# EAGLE design Butia Eagle v9 (EAGLE 5.09)
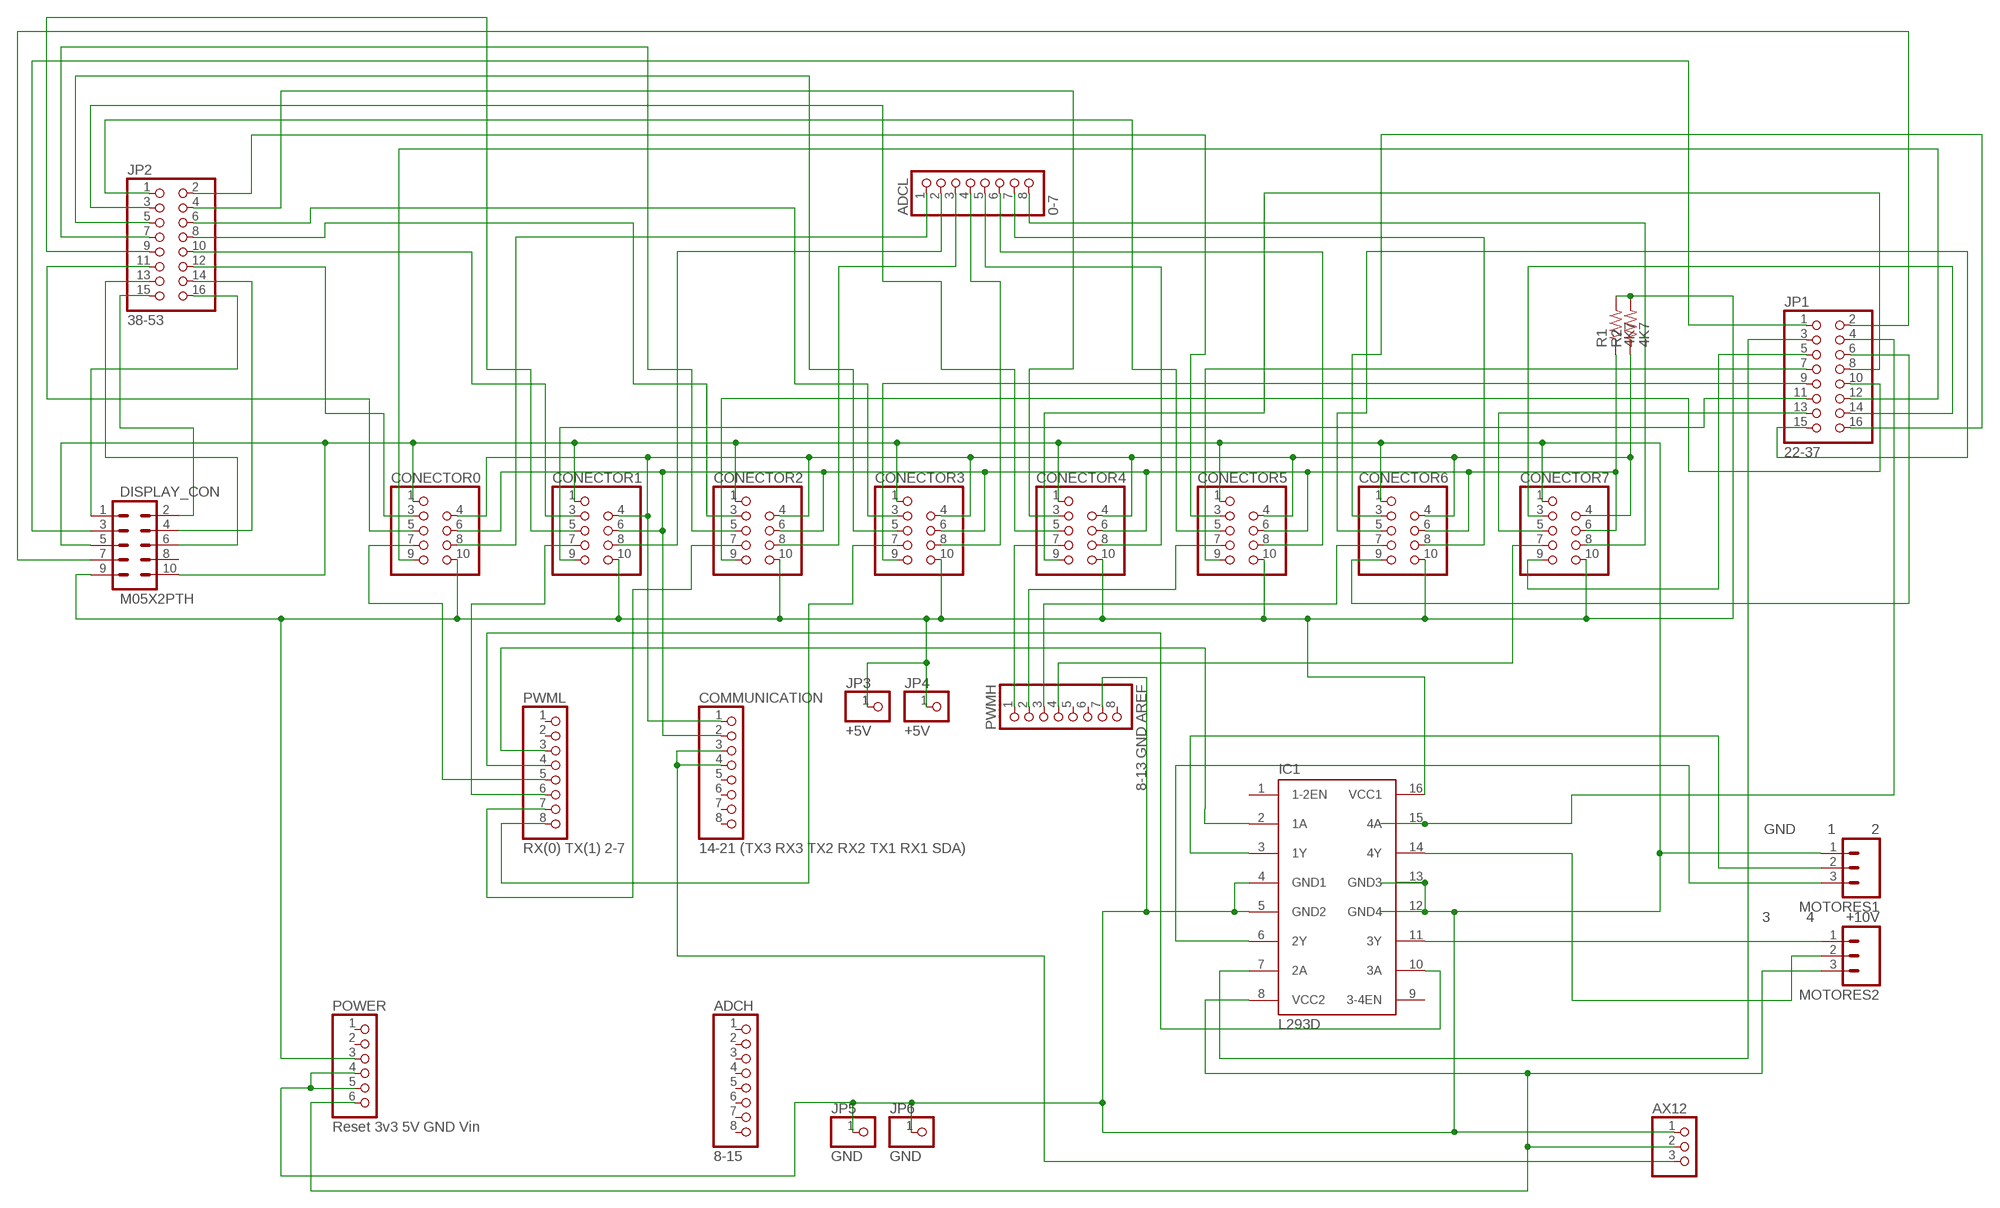
[diagram p0: schematic, sheet 1]

## Parts
ADCH  8-15  PINHD-1X8  [1X08]
ADCL  0-7  PINHD-1X8  [1X08]
AX12  AX12  [AX12]
COMMUNICATION  14-21 (TX3 RX3 TX2 RX2 TX1 RX1 SDA)  PINHD-1X8  [1X08]
CONECTOR0  9PIN  [9PIN]
CONECTOR1  9PIN  [9PIN]
CONECTOR2  9PIN  [9PIN]
CONECTOR3  9PIN  [9PIN]
CONECTOR4  9PIN  [9PIN]
CONECTOR5  9PIN  [9PIN]
CONECTOR6  9PIN  [9PIN]
CONECTOR7  9PIN  [9PIN]
DISPLAY_CON  M05X2PTH  [AVR_ICSP]
IC1  L293D  [DIL16]
JP1  22-37  PINHD-2X8  [2X08]
JP2  38-53  PINHD-2X8  [2X08]
JP3  +5V  PINHD-1X1  [1X01]
JP4  +5V  PINHD-1X1  [1X01]
JP5  GND  PINHD-1X1  [1X01]
JP6  GND  PINHD-1X1  [1X01]
MOTORES1  GND 1 2  M03SCREW_LOCK  [SCREWTERMINAL-3.5MM-3_LOCK.007S]
MOTORES2  3 4 +10V  M03SCREW_LOCK  [SCREWTERMINAL-3.5MM-3_LOCK.007S]
POWER  Reset 3v3 5V GND Vin  PINHD-1X6  [1X06]
PWMH  8-13 GND AREF  PINHD-1X8  [1X08]
PWML  RX(0) TX(1) 2-7  PINHD-1X8  [1X08]
R1  4K7  R-US_0207/7  [0207/7]
R2  4K7  R-US_0207/7  [0207/7]

## Nets
+10V [power]: AX12.2 IC1.8(VCC2) MOTORES2.3 POWER.6
MASA [gnd]: AX12.1 CONECTOR0.1 CONECTOR1.1 CONECTOR2.1 CONECTOR3.1 CONECTOR4.1 CONECTOR5.1 CONECTOR6.1 CONECTOR7.1 DISPLAY_CON.5 DISPLAY_CON.10 IC1.4(GND1) IC1.5(GND2) IC1.12(GND4) IC1.13(GND3) JP5.1 JP6.1 MOTORES1.1 POWER.4 POWER.5 PWMH.7
N$1: CONECTOR0.5 JP2.11
N$2: CONECTOR0.3 JP2.12
N$3: CONECTOR1.5 JP2.9
N$4: CONECTOR1.3 JP2.10
N$5: CONECTOR2.5 JP2.7
N$6: CONECTOR2.3 JP2.8
N$7: IC1.10(3A) PWML.4
N$8: CONECTOR3.5 JP2.5
N$9: CONECTOR3.3 JP2.6
N$10: CONECTOR4.3 JP2.4
N$11: CONECTOR4.5 JP2.3
N$13: CONECTOR5.3 JP2.2
N$15: CONECTOR6.3 JP1.16
N$16: CONECTOR7.5 JP1.13
N$17: CONECTOR7.3 JP1.14
N$18: ADCL.1 CONECTOR0.8
N$19 [polenta]: IC1.14(4Y) MOTORES2.2
N$20 [polenta]: IC1.11(3Y) MOTORES2.1
N$21 [polenta]: IC1.6(2Y) MOTORES1.3
N$22 [polenta]: IC1.3(1Y) MOTORES1.2
N$23: ADCL.2 CONECTOR1.8
N$24: ADCL.3 CONECTOR2.8
N$25: ADCL.4 CONECTOR3.8
N$26: ADCL.5 CONECTOR4.8
N$27: ADCL.6 CONECTOR5.8
N$28: ADCL.7 CONECTOR6.8
N$29: ADCL.8 CONECTOR7.8
N$30: AX12.3 COMMUNICATION.3 COMMUNICATION.4
N$31: IC1.2(1A) PWML.3
N$33: CONECTOR0.7 PWML.5
N$34: CONECTOR1.7 PWML.6
N$35: CONECTOR2.7 PWML.7
N$36: CONECTOR3.7 PWML.8
N$37: CONECTOR4.7 PWMH.1
N$38: CONECTOR5.7 PWMH.2
N$39: CONECTOR6.7 PWMH.3
N$40: CONECTOR7.7 PWMH.4
N$41: DISPLAY_CON.7 JP1.2
N$42: DISPLAY_CON.3 JP1.1
N$43: IC1.7(2A) JP1.3
N$44: IC1.15(4A) JP1.4
N$45: CONECTOR7.9 JP1.5
N$46: CONECTOR6.9 JP1.6
N$47: CONECTOR5.9 JP1.7
N$48: CONECTOR4.9 JP1.8
N$49: CONECTOR3.9 JP1.9
N$50: CONECTOR2.9 JP1.10
N$51: CONECTOR1.9 JP1.11
N$52: CONECTOR0.9 JP1.12
N$53: CONECTOR5.5 JP2.1
N$54: CONECTOR6.5 JP1.15
N$55: DISPLAY_CON.1 JP2.16
N$56: DISPLAY_CON.2 JP2.15
N$57: DISPLAY_CON.4 JP2.14
N$58: DISPLAY_CON.6 JP2.13
POSITIVO [power]: CONECTOR0.10 CONECTOR1.10 CONECTOR2.10 CONECTOR3.10 CONECTOR4.10 CONECTOR5.10 CONECTOR6.10 CONECTOR7.10 DISPLAY_CON.9 IC1.16(VCC1) JP3.1 JP4.1 POWER.3 R1.2 R2.2
SCL: COMMUNICATION.1 CONECTOR0.4 CONECTOR1.4 CONECTOR2.4 CONECTOR3.4 CONECTOR4.4 CONECTOR5.4 CONECTOR6.4 CONECTOR7.4 R2.1
SDA: COMMUNICATION.2 CONECTOR0.6 CONECTOR1.6 CONECTOR2.6 CONECTOR3.6 CONECTOR4.6 CONECTOR5.6 CONECTOR6.6 CONECTOR7.6 R1.1
Unconnected: ADCH.1 ADCH.2 ADCH.3 ADCH.4 ADCH.5 ADCH.6 ADCH.7 ADCH.8 COMMUNICATION.5 COMMUNICATION.6 COMMUNICATION.7 COMMUNICATION.8 DISPLAY_CON.8 IC1.1(1-2EN) IC1.9(3-4EN) POWER.1 POWER.2 PWMH.5 PWMH.6 PWMH.8 PWML.1 PWML.2

## Library data of the parts
ADCH ADCL COMMUNICATION PWMH PWML = pinhead:PINHD-1X8: PIN HEADER
AX12 = butia:AX12
CONECTOR0 CONECTOR1-CONECTOR7 = butia:9PIN
DISPLAY_CON = SparkFun:M05X2: Header 5x2 Standard 10-pin dual row 0.1" header. Commonly used with AVR-ISP. Use with Spark Fun Electronics SKU: PRT-00778
IC1 = st-microelectronics:L293D: PUSH-PULL 4 CHANNEL DRIVER
JP1 JP2 = pinhead:PINHD-2X8: PIN HEADER
JP3-JP6 = pinhead:PINHD-1X1: PIN HEADER
MOTORES1 MOTORES2 = SparkFun:M03: Header 3 Standard 3-pin 0.1" header. Use with straight break away headers (SKU : PRT-00116), right angle break away headers (PRT-00553), swiss pins (PRT-00743), machine pins (PRT-00117), and female headers (PRT-00115). Molex polarized connector foot print use with SKU : PRT-08232 with associated crimp pins and housings.
POWER = pinhead:PINHD-1X6: PIN HEADER
R1 R2 = resistor:R-US_: RESISTOR, American symbol

## Net classes
0 default: width 0.254 mm, drill 0.457 mm, clearance 0.203 mm
1 power: width 0.508 mm, drill 0.711 mm, clearance 0.203 mm
2 gnd: width 0.406 mm, drill 0.61 mm, clearance 0.203 mm
3 polenta: width 0.356 mm, drill 0.508 mm, clearance 0.203 mm

## Board
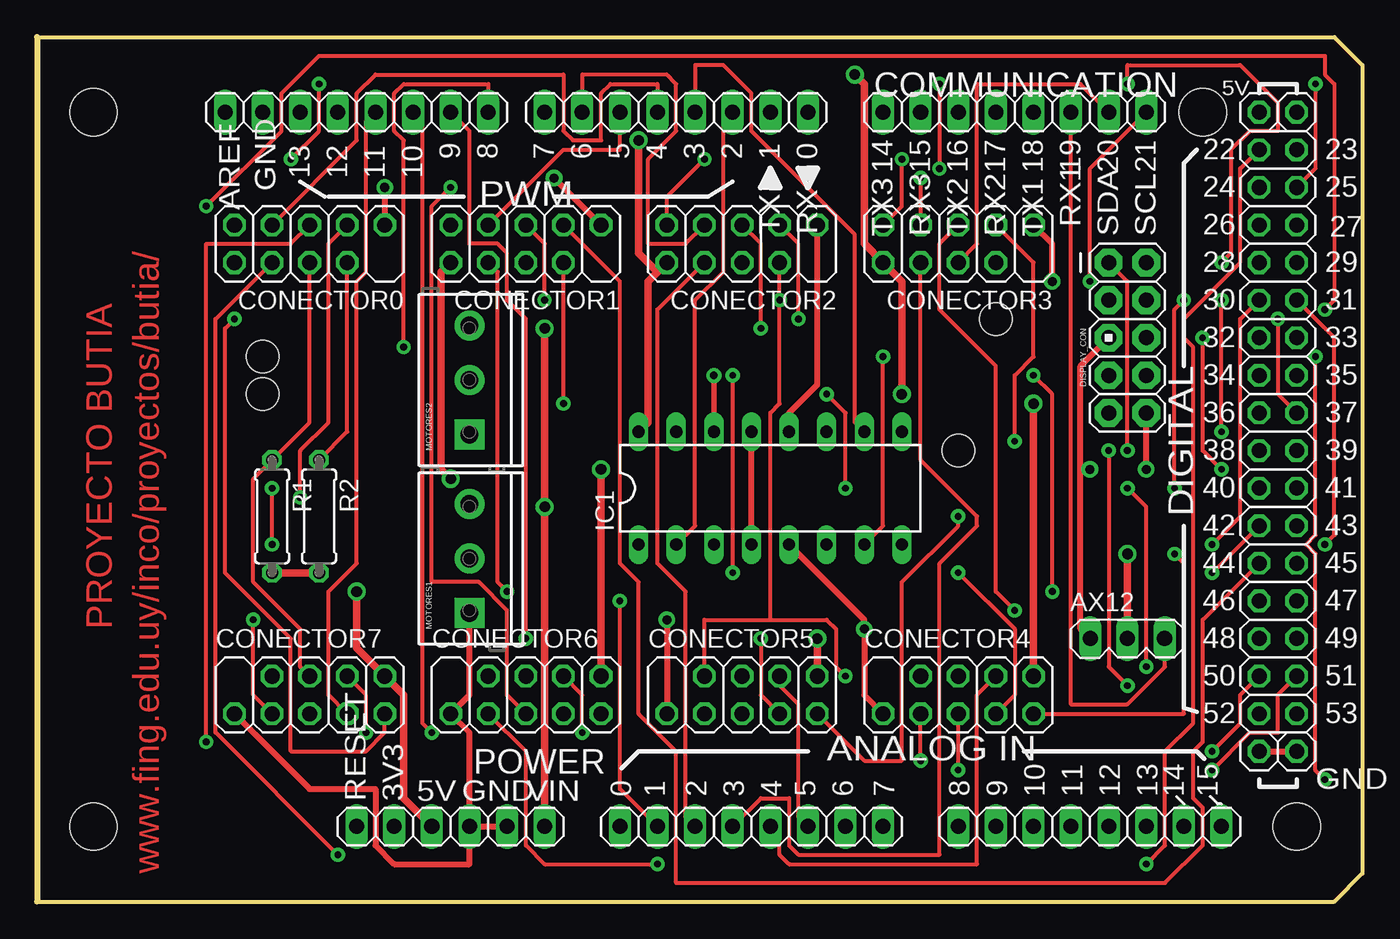
[diagram p1: board, top side]
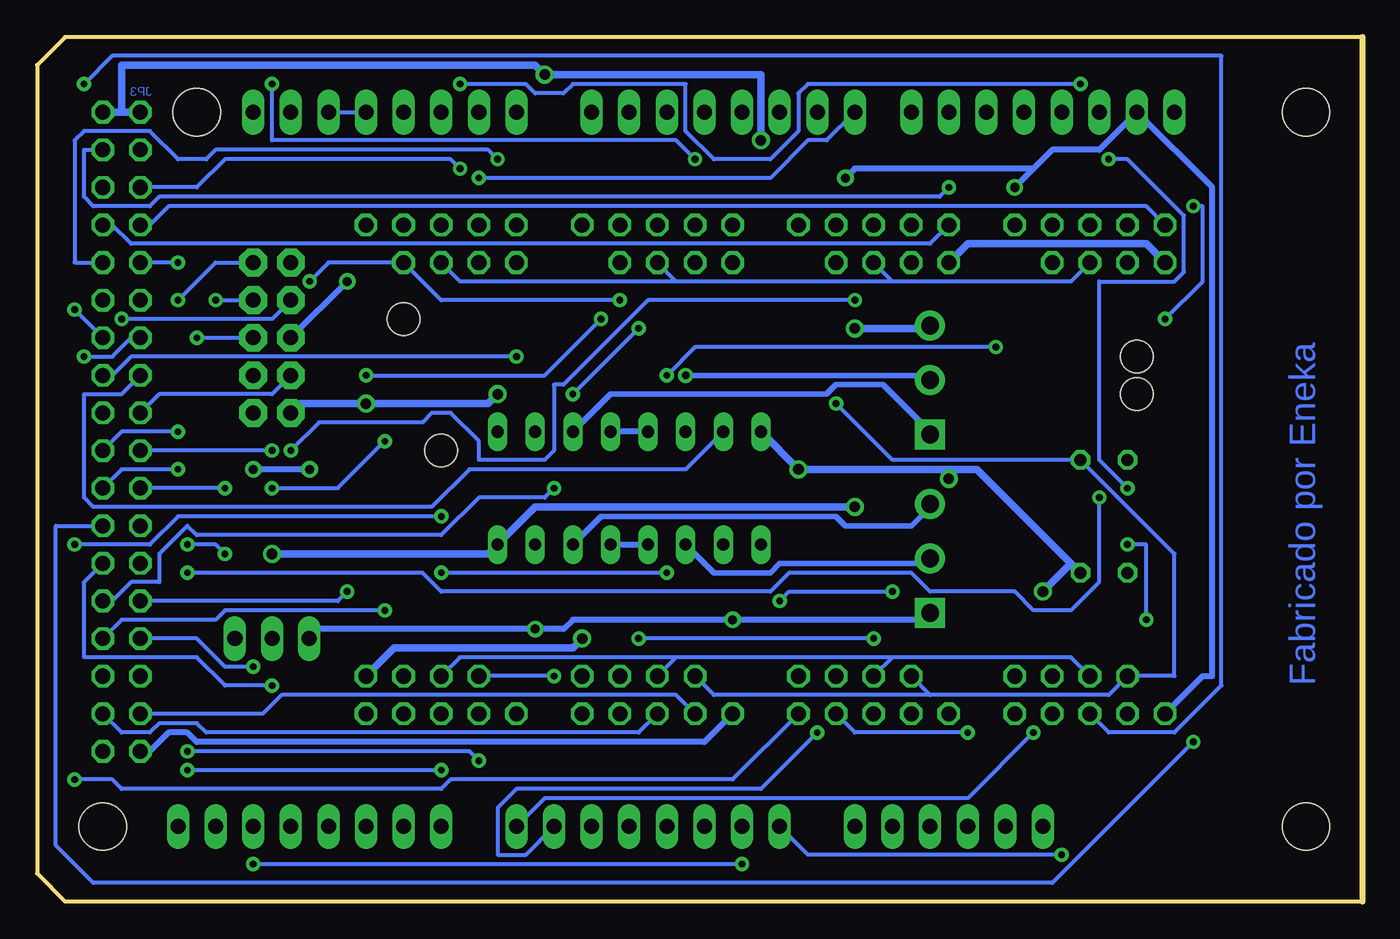
[diagram p2: board, bottom side, seen from below]

Size 89.53 x 58.42 mm. Coordinates in mm from the lower left corner, seen from the top.
Outline: 0,58.42 87.63,58.42 89.53,56.52 89.53,1.91 87.63,0 0,0 0,58.42
Copper layers (1*16): Top 0.035mm / dielectric 1.5mm / Bottom 0.035mm
Design rules "default *": minimum track width 8mil, minimum drill 16mil, track to track 8mil, track to pad 8mil, pad to pad 8mil, via to via 10mil, smd to smd 8mil, copper to edge 40mil, drill to drill 12mil, minimum pad ring 10mil, minimum via ring 10mil, stop-mask expansion 4mil, vias tented up to drill 0mil, thermal gap 10mil
Holes 3.2 mm at 85.09,5.08 3.81,53.34 78.74,53.34 3.81,5.08
Holes 2.2 mm at 64.77,39.37 15.24,36.83 15.24,34.29 62.23,30.48

### Footprints (pad centres in the part's own frame; a part is rotated, then mirrored left to right if it is on the bottom)
1X08 = drill 1.016 long: 1 -8.89,0; 2 -6.35,0; 3 -3.81,0; 4 -1.27,0; 5 1.27,0; 6 3.81,0; 7 6.35,0; 8 8.89,0
AX12 = drill 1.016 long: 1 -2.498,0; 2 0,0; 3 2.507,0.005
9PIN = drill 1.016 octagon: 1 -5.08,-1.27; 3 -2.54,-1.27; 4 -2.54,1.27; 5 0,-1.27; 6 0,1.27; 7 2.54,-1.27; 8 2.54,1.27; 9 5.08,-1.27; 10 5.08,1.27
AVR_ICSP = drill 1.016 pad 1.88 octagon: 1 -1.27,5.08; 2 1.27,5.08; 3 -1.27,2.54; 4 1.27,2.54; 5 -1.27,0; 6 1.27,0; 7 -1.27,-2.54; 8 1.27,-2.54; 9 -1.27,-5.08; 10 1.27,-5.08
DIL16 = drill 0.813 long: 1 -8.89,-3.81; 2 -6.35,-3.81; 3 -3.81,-3.81; 4 -1.27,-3.81; 5 1.27,-3.81; 6 3.81,-3.81; 7 6.35,-3.81; 8 8.89,-3.81; 9 8.89,3.81; 10 6.35,3.81; 11 3.81,3.81; 12 1.27,3.81; 13 -1.27,3.81; 14 -3.81,3.81; 15 -6.35,3.81; 16 -8.89,3.81
2X08 = drill 1.016 octagon: 1 -8.89,-1.27; 2 -8.89,1.27; 3 -6.35,-1.27; 4 -6.35,1.27; 5 -3.81,-1.27; 6 -3.81,1.27; 7 -1.27,-1.27; 8 -1.27,1.27; 9 1.27,-1.27; 10 1.27,1.27; 11 3.81,-1.27; 12 3.81,1.27; 13 6.35,-1.27; 14 6.35,1.27; 15 8.89,-1.27; 16 8.89,1.27
1X01 = drill 1.016 octagon: 1 0,0
SCREWTERMINAL-3.5MM-3_LOCK.007S = drill 1.2 pad 2.032 square: 1 -0.178,0 | drill 1.2 pad 2.032 round: 2 3.5,0; 3 7.178,0
1X06 = drill 1.016 long: 1 -6.35,0; 2 -3.81,0; 3 -1.27,0; 4 1.27,0; 5 3.81,0; 6 6.35,0
0207/7 = drill 0.813 octagon: 1 -3.81,0; 2 3.81,0

### Placement (x,y rotation side)
ADCH  71.12,5.08 0 top
ADCL  48.26,5.08 0 top
AX12  73.66,17.78 0 top
COMMUNICATION  66.04,53.34 180 top
CONECTOR0  18.41,44.45 180 top
CONECTOR1  33.02,44.45 180 top
CONECTOR2  47.62,44.45 180 top
CONECTOR3  62.23,44.45 180 top
CONECTOR4  62.23,13.97 0 top
CONECTOR5  47.62,13.97 0 top
CONECTOR6  33.02,13.97 0 top
CONECTOR7  18.41,13.97 0 top
DISPLAY_CON  73.66,38.1 0 top
IC1  49.53,27.94 0 top
JP1  83.82,41.91 90 top
JP2  83.82,21.59 90 top
JP3  82.55,53.34 0 top
JP4  85.09,53.34 0 top
JP5  82.55,10.16 0 top
JP6  85.09,10.16 0 top
MOTORES1  29.21,19.68 90 top
MOTORES2  29.21,31.75 90 top
POWER  27.94,5.08 0 top
PWMH  21.59,53.34 180 top
PWML  43.18,53.34 180 top
R1  15.88,26.04 270 top
R2  19.05,26.04 270 top

### Tracks (layer width: path | path; a pad name or v marks a point on that pad's centre or on a via)
+10V  (via drill 0.71)
  Top 0.508: v73.66,23.49 AX12.2 | v34.29,38.73 v34.29,26.67 POWER.6
  Bottom 0.508: v73.66,23.49 59.05,23.49 IC1.8 55.88,26.67 v34.29,26.67 | v34.29,38.73 29.21,38.73 MOTORES2.3
MASA  (via drill 0.61)
  Top 0.406: JP5.1 JP6.1 | CONECTOR2.1 52.71,34.92 50.8,33.02 IC1.12 | CONECTOR4.1 55.88,13.97 v55.88,18.41 55.88,19.05 IC1.5 | IC1.4 IC1.13 | 70.49,29.21 70.49,36.2 DISPLAY_CON.5 | 70.49,29.21 70.49,18.41 71.12,17.78 AX12.1 | CONECTOR3.1 68.58,44.45 v68.58,41.91 | v74.93,29.21 DISPLAY_CON.10 | 70.49,29.21 v71.12,29.21 | MOTORES1.1 29.21,13.97 CONECTOR6.1 29.21,11.43 POWER.4 | CONECTOR7.1 18.41,7.62 22.86,7.62 22.86,3.81 24.13,2.54 29.21,2.54 POWER.4 | POWER.4 POWER.5 | v23.49,48.26 CONECTOR0.1 | v34.92,48.89 CONECTOR1.1 | v42.55,19.05 CONECTOR5.1
  Bottom 0.406: CONECTOR5.1 44.45,10.8 78.74,10.8 79.38,11.43 80.65,11.43 81.91,10.16 JP5.1 | IC1.13 IC1.12 | IC1.5 IC1.4 | DISPLAY_CON.5 v68.58,41.91 | v71.12,29.21 v74.93,29.21 | CONECTOR7.1 10.8,15.24 10.16,15.24 10.16,48.26 PWMH.7 17.78,50.8 20.95,50.8 22.23,49.53 | 22.23,49.53 v23.49,48.26 | v34.92,48.89 34.29,49.53 22.23,49.53 | AX12.1 71.12,17.78 70.49,18.41 v55.88,18.41 53.98,18.41 53.34,19.05 v42.55,19.05 29.21,19.05 MOTORES1.1
N$1  (via drill 0.46)
  Top 0.254: CONECTOR0.5 17.14,44.45 11.43,44.45 v11.43,10.8
  Bottom 0.254: v11.43,10.8 20.95,1.27 85.72,1.27 88.26,3.81 88.26,25.4 JP2.11
N$2  (via drill 0.46)
  Top 0.254: v79.38,22.22 JP2.12 | v17.78,27.3 17.78,30.48 19.68,32.38 19.68,44.45 CONECTOR0.3
  Bottom 0.254: v79.38,22.22 63.5,22.22 62.23,20.95 40.01,20.95 38.73,22.22 30.48,22.22 29.21,20.95 23.49,20.95 22.23,19.68 19.68,19.68 17.78,21.59 v17.78,27.3
N$3  (via drill 0.46)
  Top 0.254: v73.66,14.61 72.39,15.88 v72.39,30.48 | v34.29,40.64 34.29,44.45 CONECTOR1.5
  Bottom 0.254: JP2.9 86.36,21.59 86.36,16.51 78.74,16.51 76.84,14.61 v73.66,14.61 | v72.39,30.48 70.49,32.38 63.5,32.38 62.87,33.02 61.6,33.02 59.69,31.11 59.69,29.84 55.24,29.84 54.61,30.48 54.61,34.92 53.98,34.92 48.26,40.64 v34.29,40.64
N$4
  Top 0.254: JP2.10 78.74,19.05 78.74,10.8 78.1,10.16 78.1,6.99 78.74,6.35 78.74,3.81 76.2,1.27 43.18,1.27 43.18,10.16 40.64,12.7 40.64,21.59 39.37,22.86 39.37,41.91 CONECTOR1.3
N$5  (via drill 0.46)
  Top 0.254: CONECTOR2.5 48.9,44.45 v48.9,38.73 | v53.34,34.29 54.61,33.02 v54.61,27.94
  Bottom 0.254: v53.34,34.29 v48.9,38.73 | v54.61,27.94 55.24,27.3 59.69,27.3 62.23,24.77 78.74,24.77 79.38,25.4 81.28,23.49 81.28,21.59 83.19,21.59 84.46,20.32 JP2.7
N$6  (via drill 0.46)
  Top 0.254: CONECTOR2.3 51.44,44.45 v51.44,39.37 | v67.31,35.56 68.58,34.29 v68.58,20.95
  Bottom 0.254: v51.44,39.37 55.24,35.56 v67.31,35.56 | v68.58,20.95 69.22,20.32 JP2.8
N$7
  Top 0.254: IC1.10 55.24,32.38 55.24,45.09 48.26,52.07 48.26,54.61 46.35,56.52 44.45,56.52 PWML.4
N$8  (via drill 0.46)
  Top 0.254: v66.04,19.68 64.77,20.95 64.77,36.2 60.96,40.01 60.96,44.45 CONECTOR3.5
  Bottom 0.254: JP2.5 83.82,19.05 77.47,19.05 76.84,19.68 v66.04,19.68
N$9  (via drill 0.46)
  Top 0.254: CONECTOR3.3 67.31,43.18 67.31,36.83 66.04,35.56 v66.04,31.11 | v73.66,27.94 74.93,26.67 v74.93,15.88
  Bottom 0.254: v66.04,31.11 69.22,27.94 v73.66,27.94 | v74.93,15.88 76.84,15.88 78.74,17.78 JP2.6
N$10  (via drill 0.46)
  Top 0.254: v59.69,9.53 CONECTOR4.3 | v79.38,10.16 81.28,12.07 81.28,13.97 JP2.4
  Bottom 0.254: v59.69,9.53 60.32,10.16 v79.38,10.16
N$11  (via drill 0.46)
  Top 0.254: v62.23,8.89 CONECTOR4.5 | v79.38,8.89 81.91,11.43 83.82,11.43 83.82,13.97 JP2.3
  Bottom 0.254: v62.23,8.89 v79.38,8.89
N$13
  Bottom 0.254: CONECTOR5.3 46.35,13.97 73.03,13.97 74.29,12.7 JP2.2
N$15  (via drill 0.46)
  Top 0.254: CONECTOR6.3 33.02,10.16 33.02,3.81 34.29,2.54 v41.91,2.54 | v74.93,2.54 76.2,3.81 76.2,10.16 78.1,12.07 78.1,37.46 77.47,38.1 77.47,39.37 81.28,43.18 81.28,49.53 JP1.16
  Bottom 0.254: v41.91,2.54 v74.93,2.54
N$16  (via drill 0.46)
  Top 0.254: v86.36,55.24 86.36,49.53 JP1.13
  Bottom 0.254: CONECTOR7.5 17.14,11.43 12.7,11.43 9.52,14.61 9.52,57.15 84.46,57.15 v86.36,55.24
N$17  (via drill 0.46)
  Top 0.254: CONECTOR7.3 14.61,13.97 v14.61,19.05 | v15.88,24.13 v15.88,27.94 | v17.14,50.16 19.05,52.07 v19.05,55.24 | v60.96,55.24 v60.96,49.53
  Bottom 0.254: v14.61,19.05 14.61,24.13 v15.88,24.13 | v15.88,27.94 17.78,29.84 17.78,41.91 12.7,41.91 12.07,42.55 12.07,46.35 15.88,50.16 v17.14,50.16 | v19.05,55.24 37.47,55.24 38.1,54.61 38.1,52.07 40.01,50.16 43.81,50.16 45.72,52.07 45.72,55.24 53.34,55.24 53.98,54.61 55.88,54.61 56.51,55.24 v60.96,55.24 | v60.96,49.53 61.6,50.16 76.84,50.16 78.74,48.26 JP1.14
N$18  (via drill 0.46)
  Top 0.254: v20.32,3.17 12.07,11.43 12.07,39.37 CONECTOR0.8
  Bottom 0.254: ADCL.1 37.47,3.17 v20.32,3.17
N$19  (via drill 0.51)
  Top 0.356: v45.72,35.56 IC1.14
  Bottom 0.356: v45.72,35.56 29.21,35.56 MOTORES2.2
N$20
  Bottom 0.356: IC1.11 50.8,34.29 36.2,34.29 35.56,34.92 32.38,34.92 29.21,31.75 MOTORES2.1
N$21
  Bottom 0.356: IC1.6 51.44,26.04 35.56,26.04 34.92,25.4 30.48,25.4 29.21,26.67 MOTORES1.3
N$22
  Bottom 0.356: IC1.3 43.81,22.22 40.01,22.22 39.37,22.86 29.21,22.86 MOTORES1.2
N$23  (via drill 0.46)
  Top 0.254: ADCL.2 39.37,7.62 v39.37,20.32 | v31.75,20.95 31.12,21.59 31.12,42.55 CONECTOR1.8
  Bottom 0.254: v39.37,20.32 38.73,20.95 v31.75,20.95
N$24
  Top 0.254: ADCL.3 43.81,5.71 43.81,20.95 41.91,22.86 41.91,40.01 CONECTOR2.8
N$25
  Top 0.254: ADCL.4 48.9,6.99 50.8,6.99 50.8,3.81 51.44,3.17 60.96,3.17 60.96,22.86 63.5,25.4 63.5,26.04 59.69,29.84 CONECTOR3.8
N$26
  Top 0.254: ADCL.5 50.16,4.45 50.16,3.17 50.8,2.54 63.5,2.54 63.5,13.97 CONECTOR4.8
N$27
  Top 0.254: ADCL.6 51.44,5.71 51.44,13.34 50.16,14.61 CONECTOR5.8
N$28  (via drill 0.46)
  Top 0.254: CONECTOR6.8 36.83,13.97 v36.83,11.43
  Bottom 0.254: v36.83,11.43 40.64,7.62 57.15,7.62 58.42,6.35 58.42,3.17 56.51,3.17 ADCL.7
N$29  (via drill 0.46)
  Top 0.254: CONECTOR7.8 22.23,13.97 v22.23,11.43
  Bottom 0.254: v22.23,11.43 26.67,6.99 55.24,6.99 ADCL.8
N$30
  Top 0.254: COMMUNICATION.3 69.85,13.34 73.66,13.34 76.2,15.88 76.2,17.78 AX12.3
  Bottom 0.254: COMMUNICATION.3 COMMUNICATION.4
N$31
  Top 0.254: IC1.2 44.45,25.4 44.45,40.64 46.35,42.55 46.35,52.7 PWML.3
N$33
  Top 0.254: CONECTOR0.7 21.59,51.44 21.59,54.61 22.86,55.88 35.56,55.88 35.56,52.07 36.2,51.44 38.1,51.44 38.1,54.61 38.73,55.24 41.91,55.24 PWML.5
N$34
  Top 0.254: CONECTOR1.7 35.56,50.8 39.37,50.8 PWML.6
N$35
  Top 0.254: CONECTOR2.7 43.81,44.45 41.27,44.45 41.27,50.16 43.18,52.07 43.18,55.24 42.55,55.88 36.83,55.88 PWML.7
N$36  (via drill 0.46)
  Top 0.254: v59.69,48.89 CONECTOR3.7
  Bottom 0.254: v59.69,48.89 40.01,48.89 37.47,51.44 36.2,51.44 PWML.8
N$37  (via drill 0.46)
  Top 0.254: CONECTOR4.7 66.04,13.97 66.04,18.41 v62.23,22.22 | v46.99,35.56 v46.99,22.22 | v24.77,37.46 24.77,51.44 24.13,52.07 24.13,54.61 24.77,55.24 30.48,55.24 PWMH.1
  Bottom 0.254: v46.99,22.22 v62.23,22.22 | v46.99,35.56 45.09,37.46 v24.77,37.46
N$38  (via drill 0.46)
  Top 0.254: CONECTOR5.7 48.9,13.97 v48.9,17.78 | v33.02,17.78 33.02,39.37 31.75,40.64 31.75,43.81 31.12,44.45 29.21,44.45 29.21,52.07 PWMH.2
  Bottom 0.254: v33.02,17.78 v48.9,17.78
N$39  (via drill 0.46)
  Top 0.254: v26.67,11.43 26.04,12.07 26.04,52.7 PWMH.3
  Bottom 0.254: CONECTOR6.7 34.29,11.43 v26.67,11.43
N$40
  Top 0.254: CONECTOR7.7 19.68,13.97 19.68,20.95 21.59,22.86 21.59,41.91 22.23,42.55 22.23,52.7 PWMH.4
N$41
  Bottom 0.254: JP1.2 81.28,34.29 73.66,34.29 DISPLAY_CON.7
N$42  (via drill 0.46)
  Top 0.254: JP1.1 83.82,34.29 v83.82,39.37
  Bottom 0.254: v83.82,39.37 73.66,39.37 DISPLAY_CON.3
N$43  (via drill 0.46)
  Top 0.254: IC1.7 57.15,25.4 v57.15,36.83
  Bottom 0.254: v57.15,36.83 83.19,36.83 84.46,35.56 JP1.3
N$44
  Bottom 0.254: IC1.15 45.72,29.21 60.32,29.21 62.87,26.67 85.72,26.67 86.36,27.3 86.36,34.29 83.82,34.29 JP1.4
N$45  (via drill 0.46)
  Top 0.254: CONECTOR7.9 23.49,11.43 22.23,10.16 17.14,10.16 17.14,17.78 12.7,22.22 12.7,38.73 v13.34,39.37 | v11.43,46.99 16.51,52.07 16.51,54.61 19.05,57.15 87,57.15 87,55.88 87.63,55.24 87.63,40.64 v87,40.01
  Bottom 0.254: v13.34,39.37 10.8,41.91 10.8,46.99 v11.43,46.99 | v87,40.01 JP1.5
N$46  (via drill 0.46)
  Top 0.254: v87,8.25 86.36,8.89 86.36,23.49 85.72,24.13 86.36,24.77 v86.36,36.83
  Bottom 0.254: CONECTOR6.9 42.55,8.25 61.6,8.25 62.23,7.62 83.82,7.62 84.46,8.25 v87,8.25 | v86.36,36.83 84.46,36.83 83.19,38.1 JP1.6
N$47  (via drill 0.46)
  Top 0.254: CONECTOR5.9 55.88,9.53 58.42,9.53 58.42,21.59 62.23,25.4 v62.23,26.04 | v87,24.13 87.63,24.77 87.63,38.1 JP1.7
  Bottom 0.254: v62.23,26.04 80.01,26.04 81.91,24.13 v87,24.13
N$48  (via drill 0.46)
  Top 0.254: CONECTOR4.9 77.47,12.7 77.47,22.86 v76.84,23.49 | v79.38,24.13 81.28,26.04 81.28,39.37 JP1.8
  Bottom 0.254: v76.84,23.49 77.47,24.13 v79.38,24.13
N$49  (via drill 0.46)
  Top 0.254: CONECTOR3.9 58.42,46.99 v58.42,50.16
  Bottom 0.254: v58.42,50.16 59.05,50.8 77.47,50.8 78.1,50.16 80.01,50.16 81.91,52.07 86.36,52.07 87,51.44 87,43.18 JP1.9
N$50  (via drill 0.46)
  Top 0.254: v80.01,43.18 80.65,43.81 80.65,50.8 81.91,52.07 83.82,52.07 83.82,53.98 81.28,56.52 73.66,56.52 v73.66,55.24 | v45.09,50.16 42.55,47.62 CONECTOR2.9
  Bottom 0.254: v80.01,43.18 JP1.10 | v73.66,55.24 73.66,51.44 46.35,51.44 v45.09,50.16
N$51
  Bottom 0.254: CONECTOR1.9 29.21,44.45 83.19,44.45 84.46,45.72 JP1.11
N$52
  Bottom 0.254: CONECTOR0.9 14.61,46.99 80.65,46.99 81.91,45.72 JP1.12
N$53
  Bottom 0.254: CONECTOR5.5 48.9,11.43 78.1,11.43 78.74,12.07 81.28,12.07 81.91,11.43 83.82,11.43 JP2.1
N$54  (via drill 0.46)
  Top 0.254: CONECTOR6.5 31.75,13.97 31.75,19.68 29.84,21.59 26.67,21.59 26.67,46.99 v27.94,48.26
  Bottom 0.254: v27.94,48.26 28.58,47.62 81.28,47.62 81.91,46.99 85.72,46.99 86.36,47.62 86.36,50.8 JP1.15
N$55  (via drill 0.46)
  Top 0.254: v73.66,30.48 73.66,41.91 DISPLAY_CON.1
  Bottom 0.254: v73.66,30.48 JP2.16
N$56  (via drill 0.46)
  Top 0.254: v80.01,31.75 v80.01,40.64
  Bottom 0.254: JP2.15 83.82,31.75 v80.01,31.75 | v80.01,40.64 77.47,43.18 DISPLAY_CON.2
N$57  (via drill 0.46)
  Top 0.254: v76.84,27.94 76.84,40.01 v77.47,40.64
  Bottom 0.254: v76.84,27.94 JP2.14 | v77.47,40.64 DISPLAY_CON.4
N$58  (via drill 0.46)
  Top 0.254: v80.01,29.21 78.74,30.48 v78.74,38.1
  Bottom 0.254: JP2.13 83.82,29.21 v80.01,29.21 | v78.74,38.1 DISPLAY_CON.6
POSITIVO  (via drill 0.71)
  Top 0.508: POWER.3 24.77,6.99 24.77,13.97 CONECTOR7.10 21.59,17.14 v21.59,20.95 | R2.2 R1.2 | IC1.16 41.27,32.38 41.27,41.91 41.91,42.55 | 41.91,42.55 CONECTOR2.10 | v38.1,29.21 CONECTOR6.10 | CONECTOR1.10 27.3,42.55 27.3,29.21 v27.94,28.57 | v52.71,17.78 CONECTOR5.10 | v58.42,34.29 58.42,41.91 CONECTOR3.10 55.88,44.45 55.88,55.24 v55.24,55.88 | v67.31,33.66 CONECTOR4.10 | 41.91,42.55 40.64,43.81 v40.64,51.44
  Bottom 0.508: CONECTOR0.10 14.61,44.45 26.67,44.45 CONECTOR1.10 | IC1.16 v38.1,29.21 27.94,29.21 | 19.68,22.86 26.04,29.21 27.94,29.21 | 19.68,22.86 R2.2 | v21.59,20.95 19.68,22.86 | 27.94,29.21 v27.94,28.57 | v52.71,17.78 53.34,17.14 65.41,17.14 CONECTOR4.10 | 83.82,53.34 JP4.1 | 83.82,53.34 JP3.1 | v58.42,34.29 59.05,33.66 v67.31,33.66 71.75,33.66 DISPLAY_CON.9 | 83.82,53.34 83.82,56.52 55.88,56.52 v55.24,55.88 40.64,55.88 v40.64,51.44
SCL  (via drill 0.46)
  Top 0.254: R2.1 20.95,31.75 CONECTOR0.4 | v35.56,33.66 CONECTOR1.4 | v54.61,15.24 53.98,15.88 53.98,18.41 53.34,19.05 49.53,19.05 | 49.53,19.05 45.09,19.05 CONECTOR5.4 | CONECTOR2.4 v50.16,40.64 50.16,33.66 49.53,33.02 49.53,19.05 | COMMUNICATION.1 71.12,49.53 v71.12,41.91
  Bottom 0.254: v35.56,33.66 31.75,29.84 R2.1 12.7,23.49 12.7,15.24 CONECTOR7.4 17.14,13.97 29.21,13.97 | 29.21,13.97 CONECTOR6.4 | CONECTOR5.4 43.81,13.97 29.21,13.97 | v54.61,15.24 CONECTOR4.4 | v50.16,40.64 62.23,40.64 CONECTOR3.4 69.85,43.18 v71.12,41.91
SDA
  Top 0.254: CONECTOR0.6 18.41,32.38 R1.1 14.61,28.57 14.61,21.59 17.78,18.41 17.78,15.88 CONECTOR7.6 | COMMUNICATION.2 70.49,55.24 63.5,55.24 63.5,44.45 CONECTOR3.6
  Bottom 0.254: CONECTOR7.6 19.68,16.51 31.75,16.51 | 31.75,16.51 CONECTOR6.6 | 46.35,16.51 CONECTOR5.6 | 31.75,16.51 46.35,16.51 | CONECTOR4.6 60.96,16.51 46.35,16.51 | 31.75,41.91 CONECTOR1.6 | 31.75,41.91 19.68,41.91 CONECTOR0.6 | 46.35,41.91 CONECTOR2.6 | 31.75,41.91 46.35,41.91 | CONECTOR3.6 60.96,41.91 46.35,41.91

### Text on the board
Top: PROYECTO BUTIA | www.fing.edu.uy/inco/proyectos/butia/
Bottom: Fabricado por Eneka
tPlace: 9 | 8 | 7 | 6 | 5 | 4 | 3 | 2 | 1 | 0 | 22 | 23 | 14 | 15 | 16 | 17 | 18 | 19 | 20 | 21 | 13 | 12 | 11 | 10 | 24 | 25 | 27 | 26 | 28 | 29 | 30 | 31 | 32 | 33 | 34 | 35 | 36 | 37 | 38 | 39 | 40 | 41 | 42 | 43 | 44 | 45 | 46 | 47 | 48 | 49 | 50 | 51 | 52 | 53 | 0 | 1 | 2 | 3 | 4 | 5 | 6 | 7 | 8 | 9 | 10 | 11 | 12 | 13 | 14 | 15
tNames: 5V | GND | AREF | PWM | TX | RX | RX1 | TX3 | RX3 | TX2 | RX2 | TX1 | SDA | SCL | DIGITAL | ANALOG IN | GND | RESET | 3V3 | 5V | GND | VIN